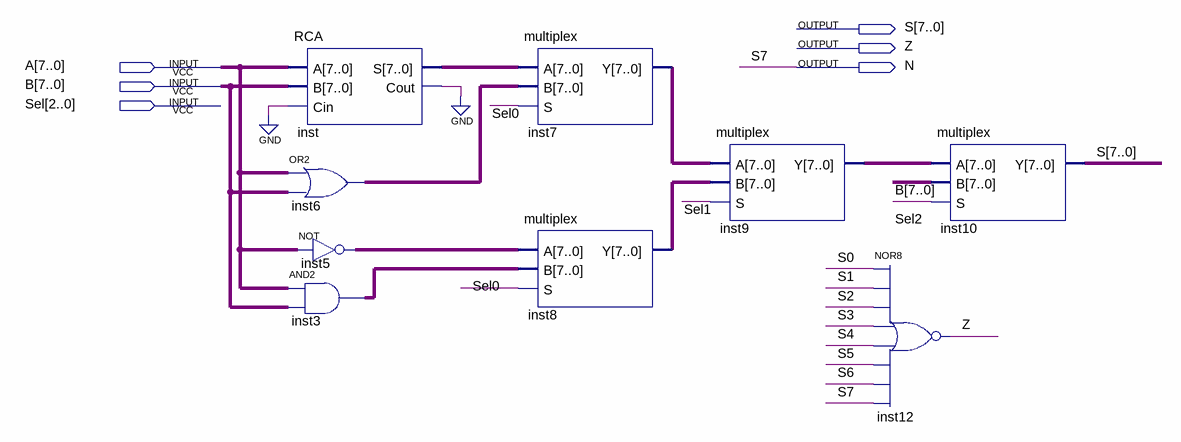
[diagram p0: schematic sheet]
// Quartus schematic ULA.bdf as structural Verilog: 9 symbols, 6 pins
module ULA (
  input  [7:0] A,
  input  [7:0] B,
  input  [2:0] Sel,
  output [7:0] S,
  output Z,
  output N
);

  wire inst_cout;
  wire [7:0] inst3_out, inst5_out, inst6_out, inst7_y, inst8_y, inst9_y, inst_s;

  RCA inst (.A(A), .B(B), .Cin(1'b0), .S(inst_s), .Cout(inst_cout));
  assign inst6_out = A | B;  // OR2 inst6, 8 bits wide
  assign inst3_out = A & B;  // AND2 inst3, 8 bits wide
  assign inst5_out = ~A;  // NOT inst5, 8 bits wide
  multiplex inst7 (.A(inst_s), .B(inst6_out), .S(Sel[0]), .Y(inst7_y));
  multiplex inst8 (.A(inst5_out), .B(inst3_out), .S(Sel[0]), .Y(inst8_y));
  multiplex inst9 (.A(inst7_y), .B(inst8_y), .S(Sel[1]), .Y(inst9_y));
  nor inst12 (Z, S[0], S[1], S[2], S[3], S[4], S[5], S[6], N);
  multiplex inst10 (.A(inst9_y), .B(B), .S(Sel[2]), .Y({N, S[6:0]}));

  assign S[7] = N;
  // also tied to GND on the sheet: inst_cout

  // Other names for the same wires on the sheet: S7 = N
endmodule
